# Altium project bangtaimau.PrjPcb
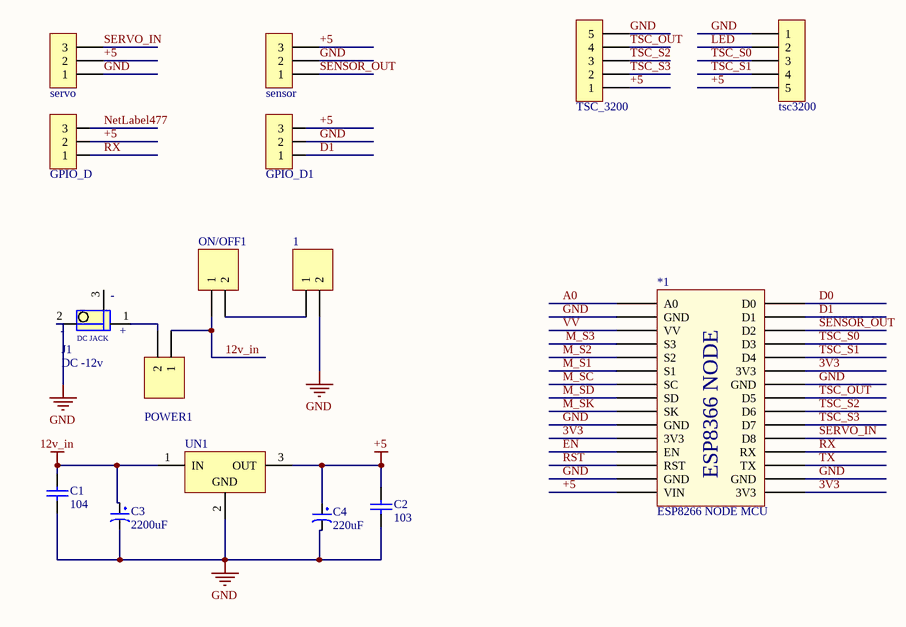
[diagram p0: Sheet2.SchDoc]
1 sheet, 16 parts. Net scope: global (net labels, ports and power ports of the same name join across sheets).
Board file: PCB1.PcbDoc

## Sheet Sheet2.SchDoc
size Letter

### Parts
1  Header 2_1  [HED2]  (value not drawn)
*1  ESP8266 NODE MCU  [ESP8266 NODE MCU]
C1  104  [tu gom]
C2  103  [tu gom]
C3  2200uF  [tu hoa 10mm]
C4  220uF  [tu hoa 6.5mm]
H1  TSC_3200  [XH2.54M-5]
H2  tsc3200  [XH2.54M-5]
H3  servo  [XH2.54M-3]
H4  sensor  [XH2.54M-3]
J1  DC -12v  [CON3_129_PJ-002A_TH_RA]
JP1  GPIO_D  [JP 1x3 DT]
JP2  GPIO_D1  [JP 1x3 DT]
ON/OFF1  Header 2_1  [HED2]  (value not drawn)
POWER1  Header 2_1  [HED2]  (value not drawn)
UN1  L78M05CP  [QTO-220H2]  (value not drawn)

### Nets
12v_in: C1.1 C3.1 ON/OFF1.1 POWER1.1 UN1.1(IN)
+5: *1.15(VIN) C2.1 C4.1 H1.1 H2.5 H3.2 H4.3 JP1.2 JP2.3 UN1.3(OUT)
GND: 1.2 *1.2(GND) *1.10(GND) *1.14(GND) *1.17(GND) *1.24(GND) C1.2 C2.2 C3.2 C4.2 H1.5 H2.1 H3.1 H4.2 J1.2 JP2.2 UN1.2(GND)
3V3: *1.11(3V3) *1.16(3V3) *1.25(3V3)
 M_S3: *1.4(S3)
A0: *1.1(A0)
D0: *1.30(D0)
D1: *1.29(D1) JP2.1
EN: *1.12(EN)
LED: H2.2
M_S1: *1.6(S1)
M_S2: *1.5(S2)
M_SC: *1.7(SC)
M_SD: *1.8(SD)
M_SK: *1.9(SK)
NetLabel477: JP1.3
RST: *1.13(RST)
RX: *1.19(RX) JP1.1
SENSOR_OUT: *1.28(D2) H4.1
SERVO_IN: *1.20(D8) H3.3
TSC_OUT: *1.23(D5) H1.4
TSC_S0: *1.27(D3) H2.3
TSC_S1: *1.26(D4) H2.4
TSC_S2: *1.22(D6) H1.3
TSC_S3: *1.21(D7) H1.2
TX: *1.18(TX)
VV: *1.3(VV)
Net1_1: 1.1 ON/OFF1.2
NetJ1_1: J1.1 POWER1.2

Not connected (* = marked no-connect by the designer): J1 3(-)

### Notes on the sheet
- (in symbol CON-PLG_3X1-228-DC_JACK) +; DC JACK
- (in symbol ESP8266 NODE MCU) ESP8366 NODE

### Library data of the parts
1 ON/OFF1 POWER1 = Header 2_1: Header, 2-Pin; Manufacturer: Generic Components; Class: Connector; Value: Header 2
C1 = Tu gom 104 50V: Cắm; So_Chan: 2; Ten_Linh_Kien: Tụ gốm 104 100nF 50V; Don_Vi: Con; Ma_Hang: MH004761; Chung_Loai: Cắm; Kieu_Chan: *
C2 = Tu gom 103 50V: Cắm; So_Chan: 2; Ten_Linh_Kien: Tụ gốm 103 10nF 50V; Don_Vi: Con; Ma_Hang: MH000936; Chung_Loai: Cắm; Kieu_Chan: *
C3 = Tu Hoa 2200uF 16V 10x20: Cắm; Don_Vi: Con; So_Chan: 2; Ten_Linh_Kien: Tụ Hóa 2200uF 16V 10x20MM; Ma_Hang: MH002316; Chung_Loai: Cắm; Kieu_Chan: *
C4 = Tu Hoa 220uF 16V 7x11: Cắm; Don_Vi: Con; Ten_Linh_Kien: Tụ Hóa 220uF 16V 7x11MM; So_Chan: 2; Ma_Hang: MH008416; Chung_Loai: Cắm; Kieu_Chan: *
H1 H2 = Header 5P 2.54 Duc Thang: Cắm; Ten_Linh_Kien: Header 5P XH2.54-5P Đực Thẳng; Don_Vi: Con; Ma_Hang: MH001298; Chung_Loai: Cắm
H3 H4 = Header 3P 2.54 Duc Thang: Cắm; Ten_Linh_Kien: Header 3P XH2.54-3P Đực Thẳng; Don_Vi: Con; Ma_Hang: MH001292; Chung_Loai: Cắm
J1 = CON-PLG_3X1-228-DC_JACK: 3 Pins, 1 Row 228mil Pitch, right angle Connector, male; Manufacturer: JST; Manufacturer Part Number: PJ-002A; Alternate Part Number-1: NA; Case/Package: TH-CON; Supplier-1: SP ROAD; Supplier Part Number-1: NA
JP1 JP2 = JP 1x3 2.54 Duc Thang: Cắm; Ten_Linh_Kien: Jump Đơn Đực 2.54MM 1x40P Thẳng 11MM; Don_Vi: Con; Ma_Hang: MH000903; Ghi_Chu: *; Kieu_Chan: *; Chung_Loai: Cắm
UN1 = L78M05CP: Positive Voltage Regulator; Note: Tab is connected to pin 3 (GND).; Published: 24-Aug-2001; LatestRevisionDate: 17-Jul-2002; LatestRevisionNote: Re-released for DXP Platform.; DatasheetVersion: Apr-1994; PackageVersion: Jul-1998; PackageReference: ISOWATT220AB; Publisher: Altium Limited; PackageDescription: TO, Thru-Hole, Vertical, Heatsink Mounted; 3 In-Line Leads; Pitch 2.54 mm; Pin sequence 1, 3, 2; ComponentLink1Description: Manufacturer Link; ComponentLink1URL: http://www.st.com/; ComponentLink2Description: Datasheet; ComponentLink2URL: http://www.st.com/stonline/products/literature/ds/2146/l78m05c.pdf